# Altium schematic sheet Magellan+ISO+-+Logic+Board.schdoc
size 345 x 174 mm
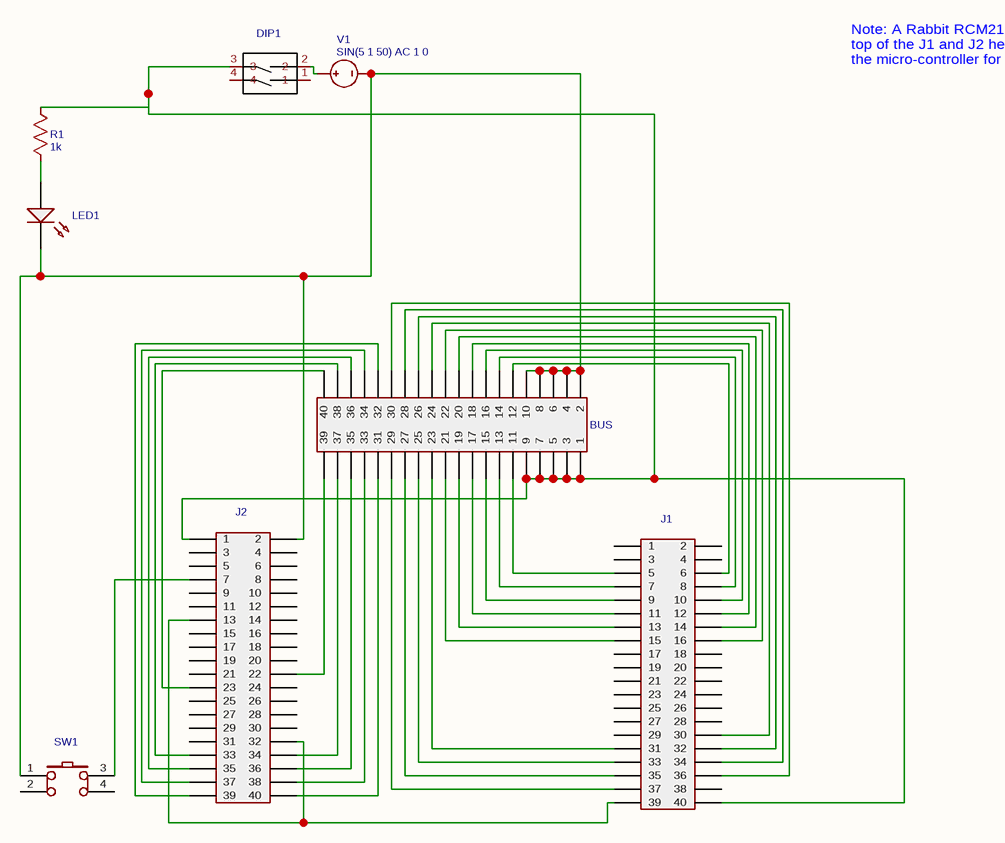
[diagram p0: Magellan+ISO+-+Logic+Board.schdoc]

## Parts
BUS  (no value)  [HDR-20X2/2.54]
DIP1  (no value)  [VDG-02HG-R]
J1  (no value)  [HDR-20X2/2.0]
J2  (no value)  [HDR-20X2/2.0]
LED1  (no value)  [LED-3MM/2.54]
R1  value 1k  [AXIAL-0.3]
SW1  (no value)  [SWITCH-6X6X5_TH]
V1  value SIN(5 1 50) AC 1 0  [HDR1X2]

## Nets
NetBUS_1: BUS.1(2) BUS.3(4) BUS.5(6) BUS.7(8) BUS.9(10) J2.2 LED1.2(C) SW1.1 V1.2
NetBUS_2: BUS.2(1) BUS.4(3) BUS.6(5) BUS.8(7) BUS.10(9) DIP1.3 J1.40 J2.1 R1.2
NetBUS_11: BUS.11(12) J1.6
NetBUS_12: BUS.12(11) J1.5
NetBUS_13: BUS.13(14) J1.8
NetBUS_14: BUS.14(13) J1.7
NetBUS_15: BUS.15(16) J1.10
NetBUS_16: BUS.16(15) J1.9
NetBUS_17: BUS.17(18) J1.12
NetBUS_18: BUS.18(17) J1.11
NetBUS_19: BUS.19(20) J1.14
NetBUS_20: BUS.20(19) J1.13
NetBUS_21: BUS.21(22) J1.16
NetBUS_22: BUS.22(21) J1.15
NetBUS_23: BUS.23(24) J1.30
NetBUS_24: BUS.24(23) J1.31
NetBUS_25: BUS.25(26) J1.32
NetBUS_26: BUS.26(25) J1.33
NetBUS_27: BUS.27(28) J1.34
NetBUS_28: BUS.28(27) J1.35
NetBUS_29: BUS.29(30) J1.36
NetBUS_30: BUS.30(29) J1.37
NetBUS_31: BUS.31(32) J2.39
NetBUS_32: BUS.32(31) BUS.34(33) BUS.36(35) BUS.38(37) J1.39 J2.13 J2.32 J2.34 J2.36 J2.38 J2.40
NetBUS_33: BUS.33(34) J2.37
NetBUS_35: BUS.35(36) J2.35
NetBUS_37: BUS.37(38) J2.33
NetBUS_39: BUS.39(40) J2.23
NetBUS_40: BUS.40(39) J2.22
NetDIP1_2: DIP1.2 V1.1
NetJ2_7: J2.7 SW1.3
NetLED1_1: LED1.1(A) R1.1

Not connected (* = marked no-connect by the designer): DIP1 1 4; J1 1 2 3 4 17 18 19 20 21 22 23 24 25 26 27 28 29 38; J2 3 4 5 6 8 9 10 11 12 14 15 16 17 18 19 20 21 24 25 26 27 28 29 30 31; SW1 2 4

## Notes on the sheet
- Note: A Rabbit RCM2110 board sits on
  top of the J1 and J2 headers.  This is
  the micro-controller for this project.

## Library data of the parts
BUS = (no symbol name): BOM_Manufacturer: ReliaPro; BOM_Manufacturer Part: 2.54mm 2*20PHeader; Value: Header-Male-2.54_2x20; BOM_Supplier: LCSC; BOM_LCSC: C50980; spicePre: P
DIP1 = (no symbol name): BOM_Manufacturer: LCSC; Value: VDG-02HG-R; BOM_LCSC: C3661; BOM_Supplier: LCSC; BOM_Manufacturer Part: VDG-02HG-R; spicePre: D
J1 J2 = (no symbol name): BOM_Manufacturer: ReliaPro; BOM_Manufacturer Part: Female header2*10P; Value: Header-Female-2.0_2x20; BOM_Supplier: LCSC; BOM_LCSC: C75756; spicePre: P
LED1 = (no symbol name): BOM_Manufacturer: EVERLIGHT; BOM_Manufacturer Part: 204-10UYC/S530-A3; Value: 204-10UYC/S530-A3; BOM_LCSC: C73643; BOM_Supplier: LCSC; spicePre: L
R1 = (no symbol name): nameAlias: Value(¦¸); BOM_Manufacturer Part: ?; spicePre: R; spiceSymbolName: Resistor
SW1 = (no symbol name): BOM_Manufacturer: LCSC; Value: SWITCH-6x6x5_TH; BOM_LCSC: C69330; BOM_Supplier: LCSC; BOM_Manufacturer Part: SWITCH-6x6x5_TH; spicePre: S
V1 = (no symbol name): nameAlias: Value; power_0: 5; BOM_Manufacturer Part: ?; spicePre: V; spiceSymbolName: Vsin